# Altium project PROC154E3_SCH.PrjPcb (part 25 of 60)

## Sheet 26. RESET BUTTONs.SchDoc: RESET BUTTONs
size 513 x 386 mm; Project: PROC154E2(001)_SK_AM69; Issue: 1.0; RevCode: E3; Page Create Date: March  8, 1995; Variant Name: Core Design; Schematic Page Number: 26; Page Number: 26; Page Size: C; Comment: MISTRAL_TITLEBLK_CSIZE_1; Page Count: 62; Schematic Page Count: 62; Name: PROC154E2 001 SK AM69; DsnPath: C:\Users\danie\Downloads\sprr466c\PROC154E3_RP\PROC154E3_SCH.DSN; SchematicName: SCHEMATIC1; PageName: 26. RESET BUTTONs; PageSize: C; TopSchematic: True
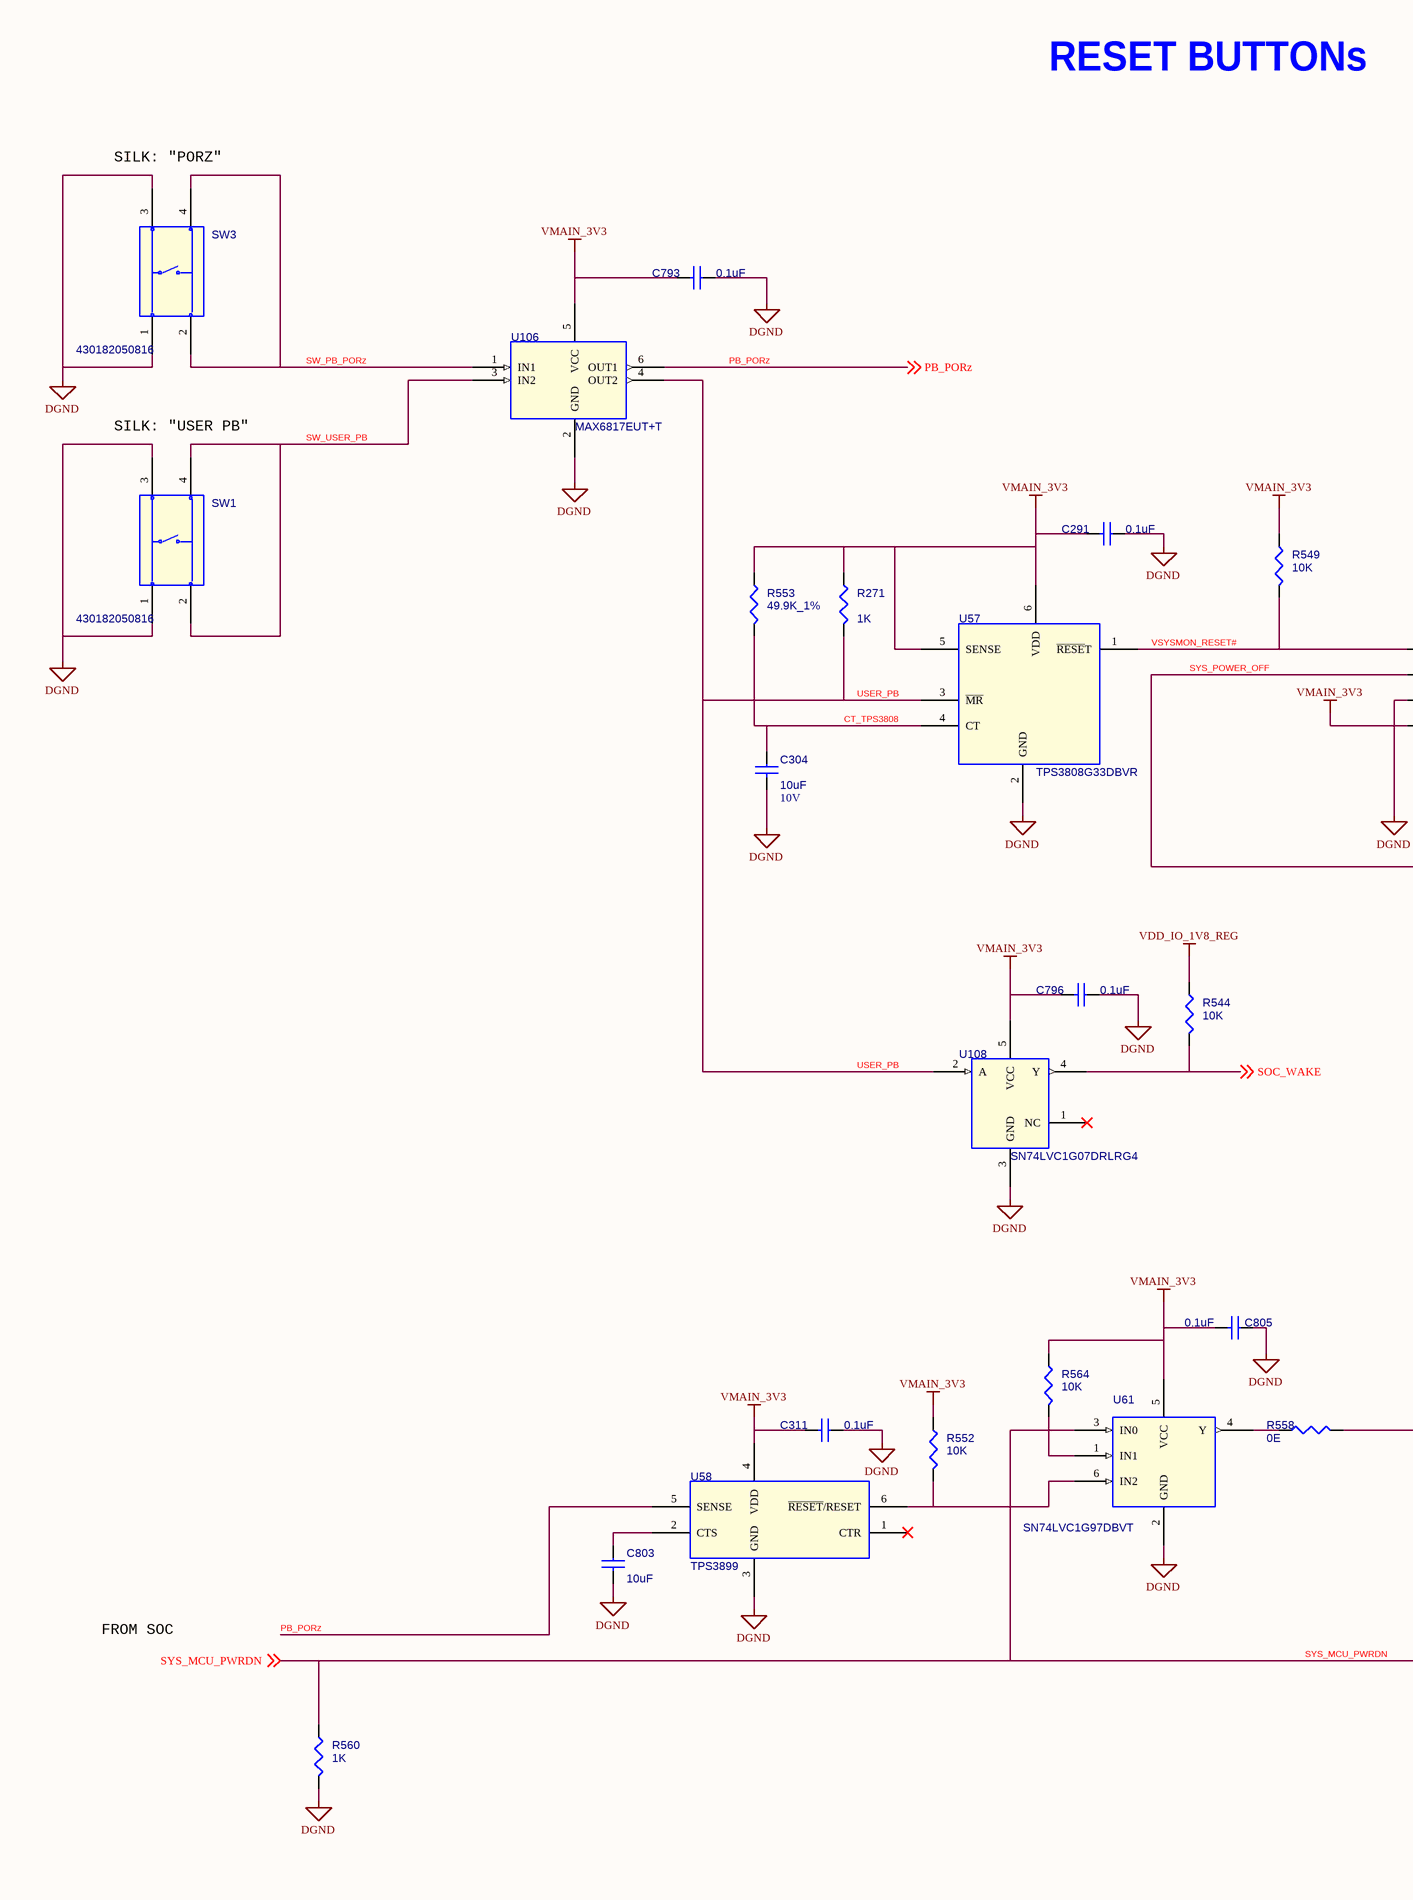
[diagram p40: 26. RESET BUTTONs.SchDoc, left]
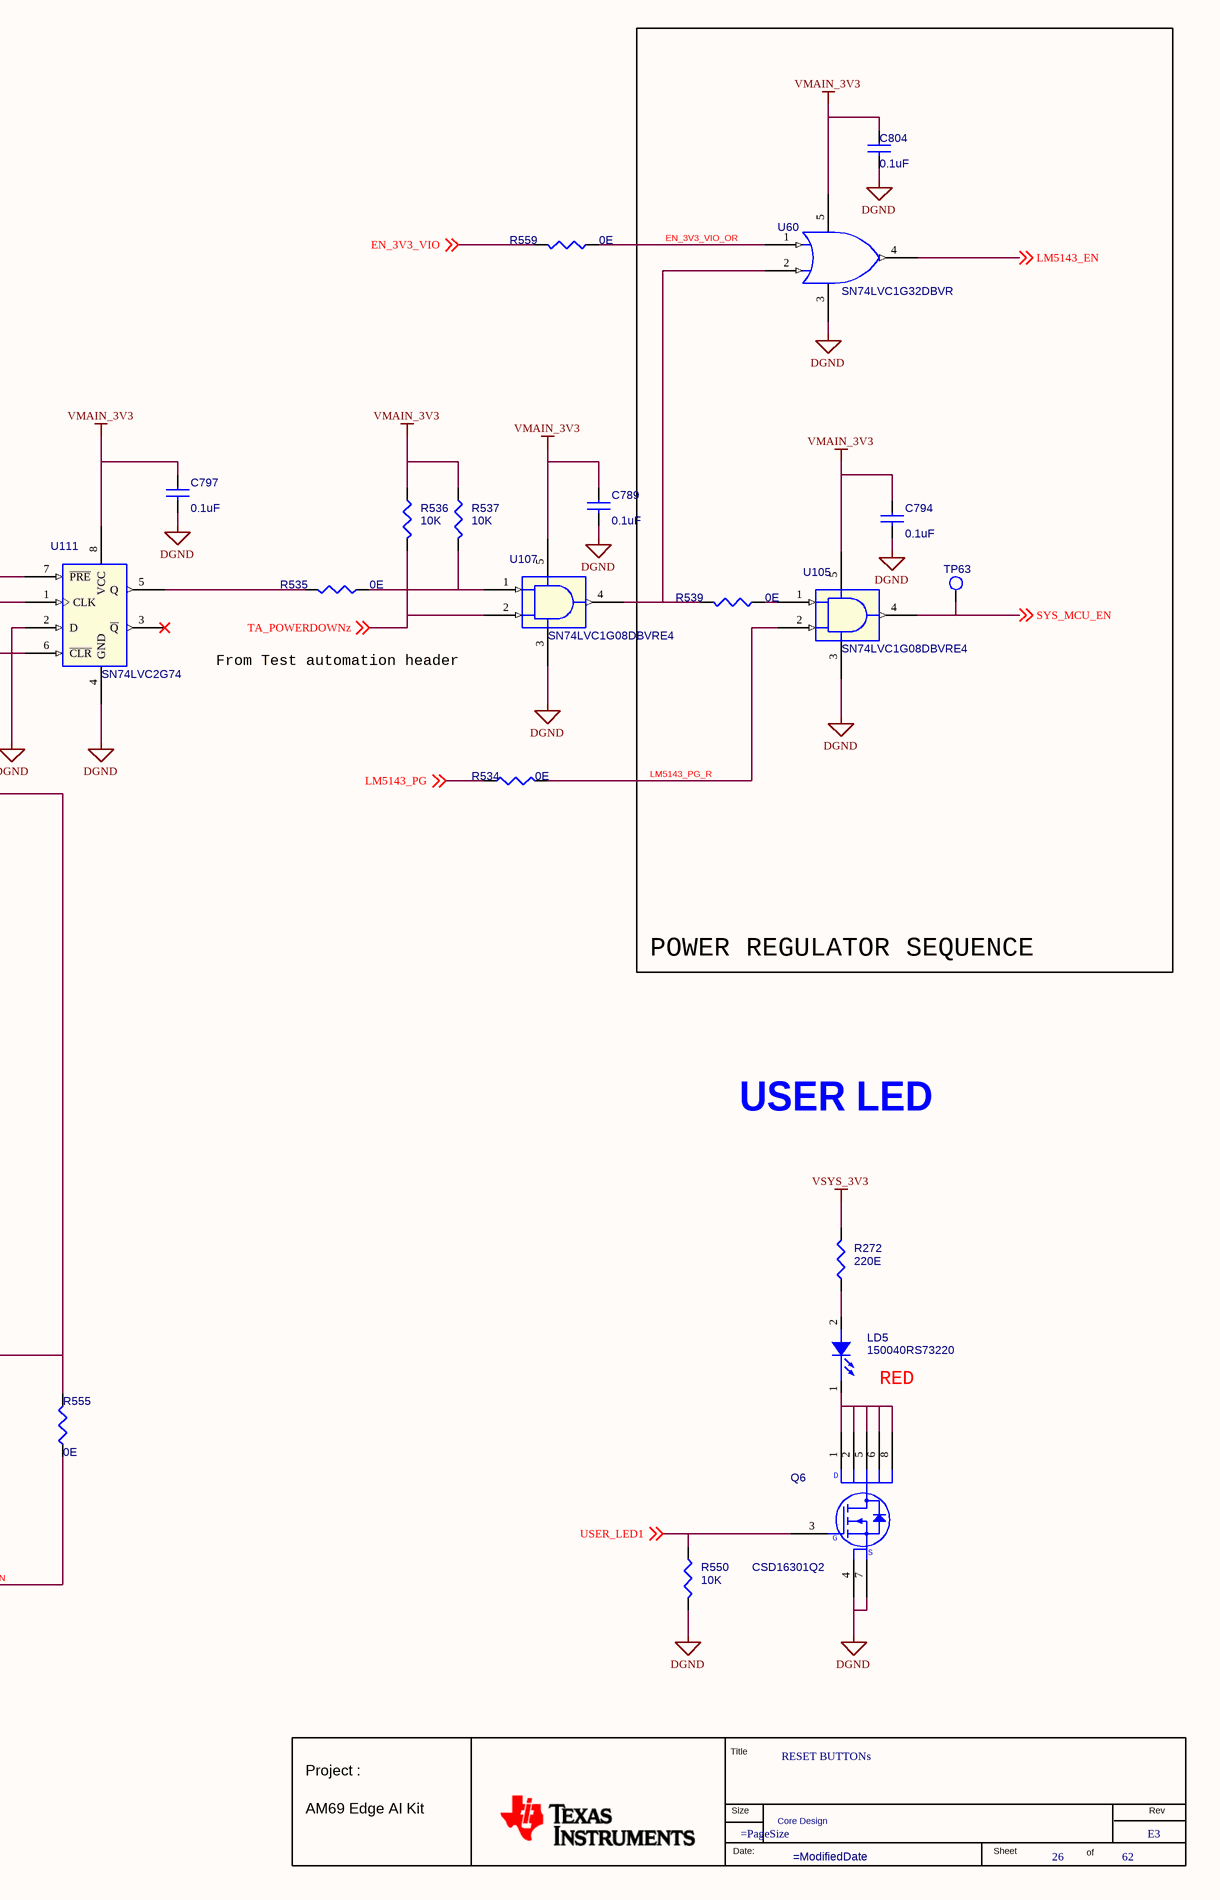
[diagram p41: 26. RESET BUTTONs.SchDoc, right]

### Parts
(Parts that share a designator on the sheet are numbered #1, #2 ... from top to bottom, then left to right.)
*#26  RevCode: E3  Title: RESET BUTTONs  Page Number: 26  Page Count: 62  Variant Name: Core Design  (hidden comment: MISTRAL_TITLEBLK_CSIZE_1)  (graphical)
C291  0.1uF  [CAP0201_0-5]
C304  10uF  Voltage: 10V  [CAP0402_1]
C311  0.1uF  [CAP0201_0-5]
C789  0.1uF  [CAP0201_0-5]
C793  0.1uF  [CAP0201_0-5]
C794  0.1uF  [CAP0201_0-5]
C796  0.1uF  [CAP0201_0-5]
C797  0.1uF  [CAP0201_0-5]
C803  10uF  [CAP0402_1]
C804  0.1uF  [CAP0201_0-5]
C805  0.1uF  [CAP0201_0-5]
LD5  150040RS73220  [LED_150040GS73220_40X20_SMD_0-4]
Q6  CSD16301Q2  [WSON6_CSD13202Q2_80X80_0-8]
R271  1K  [RES0201_0-5]
R272  220E  [RES0402_0-5]
R534  0E  [RES0402_0-5]
R535  0E  [RES0402_0-5]
R536  10K  [RES0201_0-5]
R537  10K  [RES0201_0-5]
R539  0E  [RES0402_0-5]
R544  10K  [RES0201_0-5]
R549  10K  [RES0201_0-5]
R550  10K  [RES0201_0-5]
R552  10K  [RES0201_0-5]
R553  49.9K_1%  [RES0402_0-5]
R555  0E  [RES0402_0-5]
R558  0E  [RES0402_0-5]
R559  0E  [RES0402_0-5]
R560  1K  [RES0201_0-5]
R564  10K  [RES0201_0-5]
SW1  430182050816  [SW4_430182050816_240X240_SMD_5-2]
SW3  430182050816  [SW4_430182050816_240X240_SMD_5-2]
TP63  TP30_SMD  [TP30_SMD]  (value not drawn)
U57  TPS3808G33DBVR  [SOT23-6]
U58  TPS3899  [WSON6_19-68_60X60]
U60  SN74LVC1G32DBVR  [SOT23-5_1-5]
U61  SN74LVC1G97DBVT  [SOT23-6]
U105  SN74LVC1G08DBVRE4  [SOT23-5]
U106  MAX6817EUT+T  [SOT23-6_1-5]
U107  SN74LVC1G08DBVRE4  [SOT23-5]
U108  SN74LVC1G07DRLRG4  [SOT553-5]
U111  SN74LVC2G74  [SSOP8_25-59_120X110_1-3]

### Blocks framed on the sheet
POWER REGULATOR SEQUENCE: C794 C804 R539 TP63 U60 U105

### Nets
DGND: C291.1 C304.2 C311.1 C789.2 C793.1 C794.2 C796.1 C797.2 C803.2 C804.2 C805.1 Q6.4(S1) Q6.7(S2) R550.1 R560.2 SW1.1 SW1.3 SW3.1 SW3.3 U57.2(GND) U58.3(GND) U60.3(GND) U61.2(GND) U105.3(GND) U106.2(GND) U107.3(GND) U108.3(GND) U111.2(D) U111.4(GND)  [project net VDD_CPU_HCPS_GOSNS]
VDD_IO_1V8_REG: R544.2
VMAIN_3V3: C291.2 C311.2 C789.1 C793.2 C794.1 C796.2 C797.1 C804.1 C805.2 R271.1 R536.2 R537.2 R549.2 R552.2 R553.1 R564.2 U57.5(SENSE) U57.6(VDD) U58.4(VDD) U60.5(VCC) U61.5(VCC) U105.5(VCC) U106.5(VCC) U107.5(VCC) U108.5(VCC) U111.6(~{CLR}) U111.8(VCC)
VSYS_3V3: R272.2  [project net V_3V3]
 EN_3V3_VIO_OR: R559.1 U60.1(A)
CT_TPS3808: C304.1 R553.2 U57.4(CT)
EN_3V3_VIO: R559.2 ; off-sheet EN_3V3_VIO
LM5143_EN: U60.4(Y) ; off-sheet LM5143_EN  [project net LM5143_ON]
LM5143_PG: R534.1 ; off-sheet LM5143_PG
LM5143_PG_R: R534.2 U105.2(B)
PB_PORz: U58.5(SENSE) U106.6(OUT1) ; off-sheet PB_PORz
SOC_WAKE: R544.1 U108.4(Y) ; off-sheet SOC_WAKE
SW_PB_PORz: SW3.2 SW3.4 U106.1(IN1)
SW_USER_PB: SW1.2 SW1.4 U106.3(IN2)
SYS_MCU_EN: TP63.1(TP) U105.4(Y) ; off-sheet SYS_MCU_EN
SYS_MCU_PWRDN: R555.1 R560.1 U61.3(IN0) ; off-sheet SYS_MCU_PWRDN
SYS_POWER_OFF: R555.2 R558.2 U111.1(CLK)
TA_POWERDOWNz: R536.1 U107.2(B) ; off-sheet TA_POWERDOWNz
USER_LED1: Q6.3(G) R550.2 ; off-sheet USER_LED1
USER_PB: R271.2 U57.3(~{MR}) U106.4(OUT2) U108.2(A)
VSYSMON_RESET#: R549.1 U57.1(~{RESE}T) U111.7(~{PRE})
NetC803_1: C803.1 U58.2(CTS)
NetLD5_1: LD5.1(CATHODE) Q6.1(D1) Q6.2(D2) Q6.5(D3) Q6.6(D4) Q6.8(D5)
NetLD5_2: LD5.2(ANODE) R272.1
NetR535_1: R535.1 R537.1 U107.1(A)
NetR535_2: R535.2 U111.5(Q)
NetR539_1: R539.1 U105.1(A)
NetR539_2: R539.2 U60.2(B) U107.4(Y)
NetR552_1: R552.1 U58.6(~{RESET}/RESET) U61.6(IN2)
NetR558_1: R558.1 U61.4(Y)
NetR564_1: R564.1 U61.1(IN1)

Not connected (* = marked no-connect by the designer): U58 1(CTR)*; U108 1(NC)*; U111 3(~{Q})*

### Notes on the sheet
- RESET BUTTONs
- SILK: "PORZ"
- SILK: "USER PB"
- From Test automation header
- USER LED
- (near LD5) RED
- FROM SOC
- (in symbol MISTRAL_TITLEBLK_CSIZE_1) Title; Project :; Size; Rev; AM69 Edge AI Kit; Date:; Sheet; of
- (in symbol MOSFET_CSD17313Q2) D; S

### Library data of the parts
*#26 = MISTRAL_TITLEBLK_CSIZE_1: as *#25 on sheet 25. SOC GND & KELVIN SENSING; Page Create Date: March  8, 1995; Page Size: =PageSize; Page Modify Date: =ModifiedDate; Schematic Page Count: 62; Schematic Page Number: 26
C291 = CAP_Dup1: CAP CERAMIC 0.1uF 16V 10% X7S AUTO 0201; Part Reference: C291; Mistral Part No: 120021030007-R; Mfr_name: MURATA; Mfr_part_number: GRT033C71C104KE01D; Part_type: CAPACITORS\CERAMIC; Project: J7ES_SK_BRD; Wattage: NA; Customs_HS_Code: 85322990; Custom_Duty: 15%; Value: 0.1uF; Tolerance: 10%; Voltage: 16V; Package: 0201; Distributor_name: DIGIKEY; Distributor_part_number: 490-GRT033C71C104KE01DTR-ND; Height: 0.33MM; Weight: 330mg; Temperature: -55°C+125°C; Datasheet: Y:\MIS_DATABASE\DATASHEETS\CAPACITORS\GRT033C71C104KE01.PDF; Crtd /date: ALVY/110321; Chkd/date: MANIRAJA/110321; MECHANICAL 3D STEP FILE: CAP0201_0-5; PCB Footprint: CAP0201_0-5
C304 = CAP_Dup1: CAP CERAMIC 10uF 10V 20% X5R 0402; Part Reference: C304; Mistral Part No: 120019020008-R; Mfr_name: SAMSUNG; Mfr_part_number: CL05A106MP8NUB8; Part_type: CAPACITORS\CERAMIC; Project: TI_60GHz-AOP; Customs_HS_Code: 85322990; Custom_Duty: 15%; Wattage: NA; Value: 10uF; Library Ref: CAP; Tolerance: 20%; Package: 0402; Distributor_name: DIGIKEY; Distributor_part_number: 1276-6830-1-ND; Height: 0.90MM; Datasheet: Y:\MIS_DATABASE\DATASHEETS\CAPACITORS\CL05A106MP8NUB8.PDF; Crtd /date: ALVY/150219; Chkd/date: MANIRAJA/150219; Footprint Ref: CAP0402_1; Weight: NA; Temperature: -55°C+85°C; MECHANICAL 3D STEP FILE: CAP0402_1; Library Path: Y:\MIS_DATABASE\Library\ALTIUM_TOOL\SCHEMATICS_PARTS\MS_DISCRETE_Library.schlib; Footprint Path: Y:\MIS_DATABASE\Library\ALTIUM_TOOL\PCB_FOOTPRINTS\Altium_Footprint_Lib.PcbLib; PCB Footprint: CAP0402_1
C311 = CAP_Dup1: CAP CERAMIC 0.1uF 16V 10% X7S AUTO 0201; Part Reference: C311; Mistral Part No: 120021030007-R; Mfr_name: MURATA; Mfr_part_number: GRT033C71C104KE01D; Part_type: CAPACITORS\CERAMIC; Project: J7ES_SK_BRD; Wattage: NA; Customs_HS_Code: 85322990; Custom_Duty: 15%; Value: 0.1uF; Tolerance: 10%; Voltage: 16V; Package: 0201; Distributor_name: DIGIKEY; Distributor_part_number: 490-GRT033C71C104KE01DTR-ND; Height: 0.33MM; Weight: 330mg; Temperature: -55°C+125°C; Datasheet: Y:\MIS_DATABASE\DATASHEETS\CAPACITORS\GRT033C71C104KE01.PDF; Crtd /date: ALVY/110321; Chkd/date: MANIRAJA/110321; MECHANICAL 3D STEP FILE: CAP0201_0-5; PCB Footprint: CAP0201_0-5
C789 = CAP_Dup1: CAP CERAMIC 0.1uF 16V 10% X7S AUTO 0201; Part Reference: C789; Mistral Part No: 120021030007-R; Mfr_name: MURATA; Mfr_part_number: GRT033C71C104KE01D; Part_type: CAPACITORS\CERAMIC; Project: J7ES_SK_BRD; Wattage: NA; Customs_HS_Code: 85322990; Custom_Duty: 15%; Value: 0.1uF; Tolerance: 10%; Voltage: 16V; Package: 0201; Distributor_name: DIGIKEY; Distributor_part_number: 490-GRT033C71C104KE01DTR-ND; Height: 0.33MM; Weight: 330mg; Temperature: -55°C+125°C; Datasheet: Y:\MIS_DATABASE\DATASHEETS\CAPACITORS\GRT033C71C104KE01.PDF; Crtd /date: ALVY/110321; Chkd/date: MANIRAJA/110321; MECHANICAL 3D STEP FILE: CAP0201_0-5; PCB Footprint: CAP0201_0-5
C793 = CAP_Dup1: CAP CERAMIC 0.1uF 16V 10% X7S AUTO 0201; Part Reference: C793; Part_type: CAPACITORS\CERAMIC; Mfr_part_number: GRT033C71C104KE01D; Mfr_name: MURATA; Mistral Part No: 120021030007-R; Custom_Duty: 15%; Customs_HS_Code: 85322990; Wattage: NA; Project: J7ES_SK_BRD; Value: 0.1uF; MECHANICAL 3D STEP FILE: CAP0201_0-5; Chkd/date: MANIRAJA/110321; Crtd /date: ALVY/110321; Datasheet: Y:\MIS_DATABASE\DATASHEETS\CAPACITORS\GRT033C71C104KE01.PDF; Temperature: -55°C+125°C; Weight: 330mg; Height: 0.33MM; Distributor_part_number: 490-GRT033C71C104KE01DTR-ND; Distributor_name: DIGIKEY; Package: 0201; Voltage: 16V; Tolerance: 10%; PCB Footprint: CAP0201_0-5
C794 = CAP_Dup1: CAP CERAMIC 0.1uF 16V 10% X7S AUTO 0201; Part Reference: C794; Part_type: CAPACITORS\CERAMIC; Mfr_part_number: GRT033C71C104KE01D; Mfr_name: MURATA; Mistral Part No: 120021030007-R; Custom_Duty: 15%; Customs_HS_Code: 85322990; Wattage: NA; Project: J7ES_SK_BRD; Value: 0.1uF; MECHANICAL 3D STEP FILE: CAP0201_0-5; Chkd/date: MANIRAJA/110321; Crtd /date: ALVY/110321; Datasheet: Y:\MIS_DATABASE\DATASHEETS\CAPACITORS\GRT033C71C104KE01.PDF; Temperature: -55°C+125°C; Weight: 330mg; Height: 0.33MM; Distributor_part_number: 490-GRT033C71C104KE01DTR-ND; Distributor_name: DIGIKEY; Package: 0201; Voltage: 16V; Tolerance: 10%; PCB Footprint: CAP0201_0-5
C796 = CAP_Dup1: CAP CERAMIC 0.1uF 16V 10% X7S AUTO 0201; Part Reference: C796; Part_type: CAPACITORS\CERAMIC; Mfr_part_number: GRT033C71C104KE01D; Mfr_name: MURATA; Mistral Part No: 120021030007-R; Custom_Duty: 15%; Customs_HS_Code: 85322990; Wattage: NA; Project: J7ES_SK_BRD; Value: 0.1uF; MECHANICAL 3D STEP FILE: CAP0201_0-5; Chkd/date: MANIRAJA/110321; Crtd /date: ALVY/110321; Datasheet: Y:\MIS_DATABASE\DATASHEETS\CAPACITORS\GRT033C71C104KE01.PDF; Temperature: -55°C+125°C; Weight: 330mg; Height: 0.33MM; Distributor_part_number: 490-GRT033C71C104KE01DTR-ND; Distributor_name: DIGIKEY; Package: 0201; Voltage: 16V; Tolerance: 10%; PCB Footprint: CAP0201_0-5
C797 = CAP_Dup1: CAP CERAMIC 0.1uF 16V 10% X7S AUTO 0201; Part Reference: C797; Mistral Part No: 120021030007-R; Mfr_name: MURATA; Mfr_part_number: GRT033C71C104KE01D; Part_type: CAPACITORS\CERAMIC; Project: J7ES_SK_BRD; Wattage: NA; Customs_HS_Code: 85322990; Custom_Duty: 15%; Value: 0.1uF; Tolerance: 10%; Voltage: 16V; Package: 0201; Distributor_name: DIGIKEY; Distributor_part_number: 490-GRT033C71C104KE01DTR-ND; Height: 0.33MM; Weight: 330mg; Temperature: -55°C+125°C; Datasheet: Y:\MIS_DATABASE\DATASHEETS\CAPACITORS\GRT033C71C104KE01.PDF; Crtd /date: ALVY/110321; Chkd/date: MANIRAJA/110321; MECHANICAL 3D STEP FILE: CAP0201_0-5; PCB Footprint: CAP0201_0-5
C803 = CAP_Dup1: CAP CERAMIC 10uF 10V 20% X5R 0402; Part Reference: C803; Mistral Part No: 120019020008-R; Mfr_name: SAMSUNG; Mfr_part_number: CL05A106MP8NUB8; Part_type: CAPACITORS\CERAMIC; Project: TI_60GHz-AOP; Wattage: NA; Customs_HS_Code: 85322990; Custom_Duty: 15%; Value: 10uF; Tolerance: 20%; Voltage: 10V; Package: 0402; Distributor_name: DIGIKEY; Distributor_part_number: 1276-6830-1-ND; Library Ref: CAP; Footprint Ref: CAP0402_1; Height: 0.90MM; Weight: NA; Temperature: -55°C+85°C; Datasheet: Y:\MIS_DATABASE\DATASHEETS\CAPACITORS\CL05A106MP8NUB8.PDF; Crtd /date: ALVY/150219; Chkd/date: MANIRAJA/150219; MECHANICAL 3D STEP FILE: CAP0402_1; Library Path: Y:\MIS_DATABASE\Library\ALTIUM_TOOL\SCHEMATICS_PARTS\MS_DISCRETE_Library.schlib; Footprint Path: Y:\MIS_DATABASE\Library\ALTIUM_TOOL\PCB_FOOTPRINTS\Altium_Footprint_Lib.PcbLib; PCB Footprint: CAP0402_1
C804 = CAP_Dup1: CAP CERAMIC 0.1uF 16V 10% X7S AUTO 0201; Part Reference: C804; Part_type: CAPACITORS\CERAMIC; Mfr_part_number: GRT033C71C104KE01D; Mfr_name: MURATA; Mistral Part No: 120021030007-R; Custom_Duty: 15%; Customs_HS_Code: 85322990; Wattage: NA; Project: J7ES_SK_BRD; Value: 0.1uF; MECHANICAL 3D STEP FILE: CAP0201_0-5; Chkd/date: MANIRAJA/110321; Crtd /date: ALVY/110321; Datasheet: Y:\MIS_DATABASE\DATASHEETS\CAPACITORS\GRT033C71C104KE01.PDF; Temperature: -55°C+125°C; Weight: 330mg; Height: 0.33MM; Distributor_part_number: 490-GRT033C71C104KE01DTR-ND; Distributor_name: DIGIKEY; Package: 0201; Voltage: 16V; Tolerance: 10%; PCB Footprint: CAP0201_0-5
C805 = CAP_Dup1: CAP CERAMIC 0.1uF 16V 10% X7S AUTO 0201; Part Reference: C805; Part_type: CAPACITORS\CERAMIC; Mfr_part_number: GRT033C71C104KE01D; Mfr_name: MURATA; Mistral Part No: 120021030007-R; Custom_Duty: 15%; Customs_HS_Code: 85322990; Wattage: NA; Project: J7ES_SK_BRD; Value: 0.1uF; MECHANICAL 3D STEP FILE: CAP0201_0-5; Chkd/date: MANIRAJA/110321; Crtd /date: ALVY/110321; Datasheet: Y:\MIS_DATABASE\DATASHEETS\CAPACITORS\GRT033C71C104KE01.PDF; Temperature: -55°C+125°C; Weight: 330mg; Height: 0.33MM; Distributor_part_number: 490-GRT033C71C104KE01DTR-ND; Distributor_name: DIGIKEY; Package: 0201; Voltage: 16V; Tolerance: 10%; PCB Footprint: CAP0201_0-5
LD5 = DIODE_LED: DIODE LED RED SMD; Part Reference: LD5; Part_type: OPTO\LED; Mfr_name: WURTH ELECTRONICS; Mistral Part No: 130020090020-R; Custom_Duty: 24%; Customs_HS_Code: 85439000; Wattage: NA; Project: AM64X_SKEVM; Value: 150040RS73220; PCB Footprint: LED_150040GS73220_40X20_SMD_0-4; Footprint Path: Y:\MIS_DATABASE\Library\ALTIUM_TOOL\PCB_FOOTPRINTS\Altium_Footprint_Lib.PcbLib; Library Path: Y:\MIS_DATABASE\Library\ALTIUM_TOOL\SCHEMATICS_PARTS\MS_OPTO_Library.schlib; MECHANICAL 3D STEP FILE: LED_150040GS73220_40X20_SMD_0-4; Chkd/date: MANIRAJA/100920; Crtd /date: ALVY/100920; Datasheet: Y:\MIS_DATABASE\DATASHEETS\DISCRETES\LEDS\150040RS73220.PDF; Temperature: -40°C+85°C; Weight: 29.3mg; Height: 0.35MM; Library Ref: DIODE_LED; Distributor_part_number: 732-13422-1-ND; Distributor_name: DIGIKEY; Package: SMD; Voltage: NA; Tolerance: NA; Mfr_part_number: 150040RS73220; Footprint Ref: LED_150040GS73220_40X20_SMD_0-4
Q6 = MOSFET_CSD17313Q2: IC MOSFET N-CHANNEL NEXFET 25V WSON6; Part Reference: Q6; Mistral Part No: 142020120008-R; Mfr_name: TEXAS INSTRUMENTS; Part_type: ICS\POWER\MOSFET; Project: TI_AM243x LP EVM; Tolerance: NA; Customs_HS_Code: 85423100; Custom_Duty: 15%; Value: CSD16301Q2; PCB Footprint: WSON6_CSD13202Q2_80X80_0-8; Footprint Ref: WSON6_CSD13202Q2_80X80_0-8; Mfr_part_number: CSD16301Q2; Voltage: NA; Wattage: NA; Package: WSON6; Distributor_name: DIGIKEY; Distributor_part_number: 296-25260-1-ND; Library Ref: MOSFET_CSD17313Q2; Height: 0.80MM; Weight: 8.7mg; Temperature: -55°C+150°C; Datasheet: Y:\MIS_DATABASE\DATASHEETS\ICS\POWER\CSD16301Q2.PDF; Crtd /date: MANIRAJA/071220; Chkd/date: ALVY/071220; MECHANICAL 3D STEP FILE: WSON6_CSD13202Q2_80X80_0-8; Library Path: Y:\MIS_DATABASE\Library\ALTIUM_TOOL\SCHEMATICS_PARTS\MS_MOSFET_Library.schlib; Footprint Path: Y:\MIS_DATABASE\Library\ALTIUM_TOOL\PCB_FOOTPRINTS\Altium_Footprint_Lib.PcbLib
R271 = RESISTOR_Dup1: RES 1K 1/20W 5% 0201; Part Reference: R271; Mistral Part No: 110009030395-R; Mfr_name: YAGEO AMERICA; Mfr_part_number: RC0201JR-071KL; Part_type: RESISTORS\FIXED; Project: GOLDEN-I LITE; Voltage: NA; Customs_HS_Code: 85332119; Custom_Duty: 15%; Value: 1K; Tolerance: 5%; Wattage: 1/20W; Package: 0201; Distributor_name: DIGIKEY; Distributor_part_number: 311-1KNCT-ND; Height: 0.26MM; Weight: 0.17mg; Temperature: -55°C+125°C; Datasheet: Y:\MIS_DATABASE\DATASHEETS\RESISTORS\RCXXXXL-SER_MAR18.PDF; Crtd /date: MANIRAJA/050517; Chkd/date: MANIRAJA/050517; Library Ref: RESISTOR; Footprint Ref: RES0201_0-5; MECHANICAL 3D STEP FILE: RES0201_0-5; Library Path: Y:\MIS_DATABASE\Library\ALTIUM_TOOL\SCHEMATICS_PARTS\MS_DISCRETE_Library.schlib; Footprint Path: Y:\MIS_DATABASE\Library\ALTIUM_TOOL\PCB_FOOTPRINTS\Altium_Footprint_Lib.PcbLib; PCB Footprint: RES0201_0-5
R272 = RESISTOR_Dup2: RES 220E 1/16W 5% 0402; Part Reference: R272; Part_type: RESISTORS\FIXED; Mfr_part_number: RC0402JR-07220RL; Mfr_name: YAGEO AMERICA; Mistral Part No: 110020120013-R; Custom_Duty: 15%; Customs_HS_Code: 85332119; Voltage: NA; Project: TI_AM243x LP EVM; Value: 220E; PCB Footprint: RES0402_0-5; Footprint Path: Y:\MIS_DATABASE\Library\ALTIUM_TOOL\PCB_FOOTPRINTS\Altium_Footprint_Lib.PcbLib; Library Path: Y:\MIS_DATABASE\Library\ALTIUM_TOOL\SCHEMATICS_PARTS\MS_DISCRETE_Library.schlib; Footprint Ref: RES0402_0-5; MECHANICAL 3D STEP FILE: RES0402_0-5; Chkd/date: ALVY/091220; Crtd /date: MANIRAJA/091220; Datasheet: Y:\MIS_DATABASE\DATASHEETS\RESISTORS\RCXXXXL-SER_MAR18.PDF; Temperature: -55°C+155°C; Weight: 0.65mg; Height: 0.40MM; Distributor_part_number: 311-220JRCT-ND; Distributor_name: DIGIKEY; Package: 0402; Wattage: 1/16W; Tolerance: 5%; Library Ref: RESISTOR
R534 = RESISTOR_Dup1: RES 0E 1/10W JUMPER 0402; Part Reference: R534; Part_type: RESISTORS\FIXED; Mfr_part_number: ERJ-2GE0R00X; Mfr_name: PANASONIC-ECG; Mistral Part No: 110018030052-R; Custom_Duty: 15%; Customs_HS_Code: 85332119; Voltage: NA; Project: AEGIS POM; Value: 0E; Footprint Path: Y:\MIS_DATABASE\Library\ALTIUM_TOOL\PCB_FOOTPRINTS\Altium_Footprint_Lib.PcbLib; Library Path: Y:\MIS_DATABASE\Library\ALTIUM_TOOL\SCHEMATICS_PARTS\MS_DISCRETE_Library.schlib; Footprint Ref: RES0402_0-5; Library Ref: RESISTOR; Chkd/date: VASANTHA/061216; Crtd /date: NAVEED/201014; Datasheet: Y:\MIS_DATABASE\DATASHEETS\RESISTORS\PAN-ERJSER_NOV17.PDF; Temperature: -55°C+155°C; Weight: 0.8mg; Height: 0.40MM; Distributor_part_number: P0.0JCT-ND; Distributor_name: DIGIKEY; Package: 0402; Wattage: 1/10W; Tolerance: NA; MECHANICAL 3D STEP FILE: RES0402_0-5; PCB Footprint: RES0402_0-5
R535 = RESISTOR_Dup2: RES 0E 1/10W JUMPER 0402; Part Reference: R535; Mistral Part No: 110018030052-R; Mfr_name: PANASONIC-ECG; Mfr_part_number: ERJ-2GE0R00X; Part_type: RESISTORS\FIXED; Project: AEGIS POM; Tolerance: NA; Customs_HS_Code: 85332119; Custom_Duty: 15%; Value: 0E; Footprint Path: Y:\MIS_DATABASE\Library\ALTIUM_TOOL\PCB_FOOTPRINTS\Altium_Footprint_Lib.PcbLib; Library Path: Y:\MIS_DATABASE\Library\ALTIUM_TOOL\SCHEMATICS_PARTS\MS_DISCRETE_Library.schlib; Footprint Ref: RES0402_0-5; Library Ref: RESISTOR; Voltage: NA; Wattage: 1/10W; Package: 0402; Distributor_name: DIGIKEY; Distributor_part_number: P0.0JCT-ND; Height: 0.40MM; Weight: 0.8mg; Temperature: -55°C+155°C; Datasheet: Y:\MIS_DATABASE\DATASHEETS\RESISTORS\PAN-ERJSER_NOV17.PDF; Crtd /date: NAVEED/201014; Chkd/date: VASANTHA/061216; MECHANICAL 3D STEP FILE: RES0402_0-5; PCB Footprint: RES0402_0-5
R536 = RESISTOR_Dup2: RES 10K 1/20W 5% 0201; Part Reference: R536; Mistral Part No: 110010070051-R; Mfr_name: YAGEO AMERICA; Mfr_part_number: RC0201JR-0710KL; Part_type: RESISTORS\FIXED; Project: GOLDEN-I LITE; Voltage: NA; Customs_HS_Code: 85332119; Custom_Duty: 15%; Value: 10K; Footprint Path: Y:\MIS_DATABASE\Library\ALTIUM_TOOL\PCB_FOOTPRINTS\Altium_Footprint_Lib.PcbLib; Library Path: Y:\MIS_DATABASE\Library\ALTIUM_TOOL\SCHEMATICS_PARTS\MS_DISCRETE_Library.schlib; Footprint Ref: RES0201_0-5; Library Ref: RESISTOR; Tolerance: 5%; Wattage: 1/20W; Package: 0201; Distributor_name: DIGIKEY; Distributor_part_number: 311-10KNCT-ND; Height: 0.26MM; Weight: 0.17mg; Temperature: -55°C+125°C; Datasheet: Y:\MIS_DATABASE\DATASHEETS\RESISTORS\RCXXXXL-SER_MAR18.PDF; Crtd /date: MANIRAJA/050517; Chkd/date: MANIRAJA/050517; MECHANICAL 3D STEP FILE: RES0201_0-5; PCB Footprint: RES0201_0-5
R537 = RESISTOR_Dup2: RES 10K 1/20W 5% 0201; Part Reference: R537; Mistral Part No: 110010070051-R; Mfr_name: YAGEO AMERICA; Mfr_part_number: RC0201JR-0710KL; Part_type: RESISTORS\FIXED; Project: GOLDEN-I LITE; Voltage: NA; Customs_HS_Code: 85332119; Custom_Duty: 15%; Value: 10K; Footprint Path: Y:\MIS_DATABASE\Library\ALTIUM_TOOL\PCB_FOOTPRINTS\Altium_Footprint_Lib.PcbLib; Library Path: Y:\MIS_DATABASE\Library\ALTIUM_TOOL\SCHEMATICS_PARTS\MS_DISCRETE_Library.schlib; Footprint Ref: RES0201_0-5; Library Ref: RESISTOR; Tolerance: 5%; Wattage: 1/20W; Package: 0201; Distributor_name: DIGIKEY; Distributor_part_number: 311-10KNCT-ND; Height: 0.26MM; Weight: 0.17mg; Temperature: -55°C+125°C; Datasheet: Y:\MIS_DATABASE\DATASHEETS\RESISTORS\RCXXXXL-SER_MAR18.PDF; Crtd /date: MANIRAJA/050517; Chkd/date: MANIRAJA/050517; MECHANICAL 3D STEP FILE: RES0201_0-5; PCB Footprint: RES0201_0-5
R539 = RESISTOR_Dup2: RES 0E 1/10W JUMPER 0402; Part Reference: R539; Part_type: RESISTORS\FIXED; Mfr_part_number: ERJ-2GE0R00X; Mfr_name: PANASONIC-ECG; Mistral Part No: 110018030052-R; Custom_Duty: 15%; Customs_HS_Code: 85332119; Voltage: NA; Project: AEGIS POM; Value: 0E; MECHANICAL 3D STEP FILE: RES0402_0-5; Chkd/date: VASANTHA/061216; Crtd /date: NAVEED/201014; Datasheet: Y:\MIS_DATABASE\DATASHEETS\RESISTORS\PAN-ERJSER_NOV17.PDF; Temperature: -55°C+155°C; Weight: 0.8mg; Height: 0.40MM; Distributor_part_number: P0.0JCT-ND; Distributor_name: DIGIKEY; Package: 0402; Wattage: 1/10W; Tolerance: NA; Library Ref: RESISTOR; Footprint Ref: RES0402_0-5; Library Path: Y:\MIS_DATABASE\Library\ALTIUM_TOOL\SCHEMATICS_PARTS\MS_DISCRETE_Library.schlib; Footprint Path: Y:\MIS_DATABASE\Library\ALTIUM_TOOL\PCB_FOOTPRINTS\Altium_Footprint_Lib.PcbLib; PCB Footprint: RES0402_0-5
R544 = RESISTOR_Dup2: RES 10K 1/20W 5% 0201; Part Reference: R544; Part_type: RESISTORS\FIXED; Mfr_part_number: RC0201JR-0710KL; Mfr_name: YAGEO AMERICA; Mistral Part No: 110010070051-R; Custom_Duty: 15%; Customs_HS_Code: 85332119; Voltage: NA; Project: GOLDEN-I LITE; Value: 10K; MECHANICAL 3D STEP FILE: RES0201_0-5; Chkd/date: MANIRAJA/050517; Crtd /date: MANIRAJA/050517; Datasheet: Y:\MIS_DATABASE\DATASHEETS\RESISTORS\RCXXXXL-SER_MAR18.PDF; Temperature: -55°C+125°C; Weight: 0.17mg; Height: 0.26MM; Distributor_part_number: 311-10KNCT-ND; Distributor_name: DIGIKEY; Package: 0201; Wattage: 1/20W; Tolerance: 5%; Library Ref: RESISTOR; Footprint Ref: RES0201_0-5; Library Path: Y:\MIS_DATABASE\Library\ALTIUM_TOOL\SCHEMATICS_PARTS\MS_DISCRETE_Library.schlib; Footprint Path: Y:\MIS_DATABASE\Library\ALTIUM_TOOL\PCB_FOOTPRINTS\Altium_Footprint_Lib.PcbLib; PCB Footprint: RES0201_0-5
R549 = RESISTOR_Dup2: RES 10K 1/20W 5% 0201; Part Reference: R549; Mistral Part No: 110010070051-R; Mfr_name: YAGEO AMERICA; Mfr_part_number: RC0201JR-0710KL; Part_type: RESISTORS\FIXED; Project: GOLDEN-I LITE; Voltage: NA; Customs_HS_Code: 85332119; Custom_Duty: 15%; Value: 10K; Footprint Path: Y:\MIS_DATABASE\Library\ALTIUM_TOOL\PCB_FOOTPRINTS\Altium_Footprint_Lib.PcbLib; Library Path: Y:\MIS_DATABASE\Library\ALTIUM_TOOL\SCHEMATICS_PARTS\MS_DISCRETE_Library.schlib; Footprint Ref: RES0201_0-5; Library Ref: RESISTOR; Tolerance: 5%; Wattage: 1/20W; Package: 0201; Distributor_name: DIGIKEY; Distributor_part_number: 311-10KNCT-ND; Height: 0.26MM; Weight: 0.17mg; Temperature: -55°C+125°C; Datasheet: Y:\MIS_DATABASE\DATASHEETS\RESISTORS\RCXXXXL-SER_MAR18.PDF; Crtd /date: MANIRAJA/050517; Chkd/date: MANIRAJA/050517; MECHANICAL 3D STEP FILE: RES0201_0-5; PCB Footprint: RES0201_0-5
R550 = RESISTOR_Dup2: RES 10K 1/20W 5% 0201; Part Reference: R550; Mistral Part No: 110010070051-R; Mfr_name: YAGEO AMERICA; Mfr_part_number: RC0201JR-0710KL; Part_type: RESISTORS\FIXED; Project: GOLDEN-I LITE; Voltage: NA; Customs_HS_Code: 85332119; Custom_Duty: 15%; Value: 10K; PCB Footprint: RES0201_0-5; Footprint Path: Y:\MIS_DATABASE\Library\ALTIUM_TOOL\PCB_FOOTPRINTS\Altium_Footprint_Lib.PcbLib; Library Path: Y:\MIS_DATABASE\Library\ALTIUM_TOOL\SCHEMATICS_PARTS\MS_DISCRETE_Library.schlib; Footprint Ref: RES0201_0-5; Library Ref: RESISTOR; Tolerance: 5%; Wattage: 1/20W; Package: 0201; Distributor_name: DIGIKEY; Distributor_part_number: 311-10KNCT-ND; Height: 0.26MM; Weight: 0.17mg; Temperature: -55°C+125°C; Datasheet: Y:\MIS_DATABASE\DATASHEETS\RESISTORS\RCXXXXL-SER_MAR18.PDF; Crtd /date: MANIRAJA/050517; Chkd/date: MANIRAJA/050517; MECHANICAL 3D STEP FILE: RES0201_0-5
R552 = RESISTOR_Dup2: RES 10K 1/20W 5% 0201; Part Reference: R552; Part_type: RESISTORS\FIXED; Mfr_part_number: RC0201JR-0710KL; Mfr_name: YAGEO AMERICA; Mistral Part No: 110010070051-R; Custom_Duty: 15%; Customs_HS_Code: 85332119; Voltage: NA; Project: GOLDEN-I LITE; Value: 10K; MECHANICAL 3D STEP FILE: RES0201_0-5; Chkd/date: MANIRAJA/050517; Crtd /date: MANIRAJA/050517; Datasheet: Y:\MIS_DATABASE\DATASHEETS\RESISTORS\RCXXXXL-SER_MAR18.PDF; Temperature: -55°C+125°C; Weight: 0.17mg; Height: 0.26MM; Distributor_part_number: 311-10KNCT-ND; Distributor_name: DIGIKEY; Package: 0201; Wattage: 1/20W; Tolerance: 5%; Library Ref: RESISTOR; Footprint Ref: RES0201_0-5; Library Path: Y:\MIS_DATABASE\Library\ALTIUM_TOOL\SCHEMATICS_PARTS\MS_DISCRETE_Library.schlib; Footprint Path: Y:\MIS_DATABASE\Library\ALTIUM_TOOL\PCB_FOOTPRINTS\Altium_Footprint_Lib.PcbLib; PCB Footprint: RES0201_0-5
R553 = RESISTOR_Dup2: RES 49.9K 1/16W 1% 0402; Part Reference: R553; Mistral Part No: 110009030902-R; Mfr_name: VISHAY; Mfr_part_number: CRCW040249K9FKED; Part_type: RESISTORS\FIXED; Project: OMAP_EVM; Voltage: NA; Customs_HS_Code: 85332119; Custom_Duty: 15%; Value: 49.9K_1%; Footprint Ref: RES0402_0-5; Tolerance: 1%; Wattage: 1/16W; Package: 0402; Distributor_name: DIGIKEY; Distributor_part_number: 541-49.9KLCT-ND; Library Ref: RESISTOR; Height: 0.40MM; Weight: 0.65mg; Temperature: -55°C+155°C; Datasheet: Y:\MIS_DATABASE\DATASHEETS\RESISTORS\CRCW0603.PDF; Crtd /date: USMAN/060109; Chkd/date: MANIRAJA/190318; MECHANICAL 3D STEP FILE: RES0402_0-5; Library Path: Y:\MIS_DATABASE\Library\ALTIUM_TOOL\SCHEMATICS_PARTS\MS_DISCRETE_Library.schlib; Footprint Path: Y:\MIS_DATABASE\Library\ALTIUM_TOOL\PCB_FOOTPRINTS\Altium_Footprint_Lib.PcbLib; PCB Footprint: RES0402_0-5
R555 = RESISTOR_Dup1: RES 0E 1/10W JUMPER 0402; Part Reference: R555; Mistral Part No: 110018030052-R; Mfr_name: PANASONIC-ECG; Mfr_part_number: ERJ-2GE0R00X; Part_type: RESISTORS\FIXED; Project: AEGIS POM; Tolerance: NA; Customs_HS_Code: 85332119; Custom_Duty: 15%; Value: 0E; PCB Footprint: RES0402_0-5; MECHANICAL 3D STEP FILE: RES0402_0-5; Voltage: NA; Wattage: 1/10W; Package: 0402; Distributor_name: DIGIKEY; Distributor_part_number: P0.0JCT-ND; Height: 0.40MM; Weight: 0.8mg; Temperature: -55°C+155°C; Datasheet: Y:\MIS_DATABASE\DATASHEETS\RESISTORS\PAN-ERJSER_NOV17.PDF; Crtd /date: NAVEED/201014; Chkd/date: VASANTHA/061216; Library Ref: RESISTOR; Footprint Ref: RES0402_0-5; Library Path: Y:\MIS_DATABASE\Library\ALTIUM_TOOL\SCHEMATICS_PARTS\MS_DISCRETE_Library.schlib; Footprint Path: Y:\MIS_DATABASE\Library\ALTIUM_TOOL\PCB_FOOTPRINTS\Altium_Footprint_Lib.PcbLib
R558 = RESISTOR_Dup1: RES 0E 1/10W JUMPER 0402; Part Reference: R558; Part_type: RESISTORS\FIXED; Mfr_part_number: ERJ-2GE0R00X; Mfr_name: PANASONIC-ECG; Mistral Part No: 110018030052-R; Custom_Duty: 15%; Customs_HS_Code: 85332119; Voltage: NA; Project: AEGIS POM; Value: 0E; Footprint Path: Y:\MIS_DATABASE\Library\ALTIUM_TOOL\PCB_FOOTPRINTS\Altium_Footprint_Lib.PcbLib; Library Path: Y:\MIS_DATABASE\Library\ALTIUM_TOOL\SCHEMATICS_PARTS\MS_DISCRETE_Library.schlib; Footprint Ref: RES0402_0-5; Library Ref: RESISTOR; Chkd/date: VASANTHA/061216; Crtd /date: NAVEED/201014; Datasheet: Y:\MIS_DATABASE\DATASHEETS\RESISTORS\PAN-ERJSER_NOV17.PDF; Temperature: -55°C+155°C; Weight: 0.8mg; Height: 0.40MM; Distributor_part_number: P0.0JCT-ND; Distributor_name: DIGIKEY; Package: 0402; Wattage: 1/10W; Tolerance: NA; MECHANICAL 3D STEP FILE: RES0402_0-5; PCB Footprint: RES0402_0-5
R559 = RESISTOR_Dup2: RES 0E 1/10W JUMPER 0402; Part Reference: R559; Part_type: RESISTORS\FIXED; Mfr_part_number: ERJ-2GE0R00X; Mfr_name: PANASONIC-ECG; Mistral Part No: 110018030052-R; Custom_Duty: 15%; Customs_HS_Code: 85332119; Voltage: NA; Project: AEGIS POM; Value: 0E; MECHANICAL 3D STEP FILE: RES0402_0-5; Chkd/date: VASANTHA/061216; Crtd /date: NAVEED/201014; Datasheet: Y:\MIS_DATABASE\DATASHEETS\RESISTORS\PAN-ERJSER_NOV17.PDF; Temperature: -55°C+155°C; Weight: 0.8mg; Height: 0.40MM; Distributor_part_number: P0.0JCT-ND; Distributor_name: DIGIKEY; Package: 0402; Wattage: 1/10W; Tolerance: NA; Library Ref: RESISTOR; Footprint Ref: RES0402_0-5; Library Path: Y:\MIS_DATABASE\Library\ALTIUM_TOOL\SCHEMATICS_PARTS\MS_DISCRETE_Library.schlib; Footprint Path: Y:\MIS_DATABASE\Library\ALTIUM_TOOL\PCB_FOOTPRINTS\Altium_Footprint_Lib.PcbLib; PCB Footprint: RES0402_0-5
R560 = RESISTOR_Dup1: RES 1K 1/20W 5% 0201; Part Reference: R560; Part_type: RESISTORS\FIXED; Mfr_part_number: RC0201JR-071KL; Mfr_name: YAGEO AMERICA; Mistral Part No: 110009030395-R; Custom_Duty: 15%; Customs_HS_Code: 85332119; Voltage: NA; Project: GOLDEN-I LITE; Value: 1K; Footprint Path: Y:\MIS_DATABASE\Library\ALTIUM_TOOL\PCB_FOOTPRINTS\Altium_Footprint_Lib.PcbLib; Library Path: Y:\MIS_DATABASE\Library\ALTIUM_TOOL\SCHEMATICS_PARTS\MS_DISCRETE_Library.schlib; MECHANICAL 3D STEP FILE: RES0201_0-5; Footprint Ref: RES0201_0-5; Library Ref: RESISTOR; Chkd/date: MANIRAJA/050517; Crtd /date: MANIRAJA/050517; Datasheet: Y:\MIS_DATABASE\DATASHEETS\RESISTORS\RCXXXXL-SER_MAR18.PDF; Temperature: -55°C+125°C; Weight: 0.17mg; Height: 0.26MM; Distributor_part_number: 311-1KNCT-ND; Distributor_name: DIGIKEY; Package: 0201; Wattage: 1/20W; Tolerance: 5%; PCB Footprint: RES0201_0-5
R564 = RESISTOR_Dup2: RES 10K 1/20W 5% 0201; Part Reference: R564; Part_type: RESISTORS\FIXED; Mfr_part_number: RC0201JR-0710KL; Mfr_name: YAGEO AMERICA; Mistral Part No: 110010070051-R; Custom_Duty: 15%; Customs_HS_Code: 85332119; Voltage: NA; Project: GOLDEN-I LITE; Value: 10K; MECHANICAL 3D STEP FILE: RES0201_0-5; Chkd/date: MANIRAJA/050517; Crtd /date: MANIRAJA/050517; Datasheet: Y:\MIS_DATABASE\DATASHEETS\RESISTORS\RCXXXXL-SER_MAR18.PDF; Temperature: -55°C+125°C; Weight: 0.17mg; Height: 0.26MM; Distributor_part_number: 311-10KNCT-ND; Distributor_name: DIGIKEY; Package: 0201; Wattage: 1/20W; Tolerance: 5%; Library Ref: RESISTOR; Footprint Ref: RES0201_0-5; Library Path: Y:\MIS_DATABASE\Library\ALTIUM_TOOL\SCHEMATICS_PARTS\MS_DISCRETE_Library.schlib; Footprint Path: Y:\MIS_DATABASE\Library\ALTIUM_TOOL\PCB_FOOTPRINTS\Altium_Footprint_Lib.PcbLib; PCB Footprint: RES0201_0-5
SW1 = SW4_430182050816: SWITCH TACTILE SPST ST SMD; Part Reference: SW1; Part_type: ELECTRO-MECHANICAL\SWITCH; Mfr_name: WURTH ELEKTRONIK; Mistral Part No: 130021010021-R; Custom_Duty: 24%; Customs_HS_Code: 85369090; Wattage: NA; Project: TI_DRA829 SK EVM BRD; Value: 430182050816; Footprint Path: Y:\MIS_DATABASE\Library\ALTIUM_TOOL\PCB_FOOTPRINTS\Altium_Footprint_Lib.PcbLib; Library Path: Y:\MIS_DATABASE\Library\ALTIUM_TOOL\SCHEMATICS_PARTS\MS_SWITCH_Library.schlib; MECHANICAL 3D STEP FILE: SW4_430182050816_240X240_SMD_5-2; Chkd/date: MANIRAJA/180121; Crtd /date: ALVY/180121; Datasheet: Y:\MIS_DATABASE\DATASHEETS\MISC\SWITCHES\4301X2XXX816.PDF; Temperature: -40°C+85°C; Weight: 220mg; Height: 5.15MM; Library Ref: SW4_430182050816; Distributor_part_number: 732-7005-1-ND; Distributor_name: DIGIKEY; Package: SMD; Voltage: NA; Tolerance: NA; Mfr_part_number: 430182050816; Footprint Ref: SW4_430182050816_240X240_SMD_5-2; PCB Footprint: SW4_430182050816_240X240_SMD_5-2
SW3 = SW4_430182050816: SWITCH TACTILE SPST ST SMD; Part Reference: SW3; Mistral Part No: 130021010021-R; Mfr_name: WURTH ELEKTRONIK; Part_type: ELECTRO-MECHANICAL\SWITCH; Project: TI_DRA829 SK EVM BRD; Tolerance: NA; Customs_HS_Code: 85369090; Custom_Duty: 24%; Value: 430182050816; Footprint Ref: SW4_430182050816_240X240_SMD_5-2; Mfr_part_number: 430182050816; Voltage: NA; Wattage: NA; Package: SMD; Distributor_name: DIGIKEY; Distributor_part_number: 732-7005-1-ND; Library Ref: SW4_430182050816; Height: 5.15MM; Weight: 220mg; Temperature: -40°C+85°C; Datasheet: Y:\MIS_DATABASE\DATASHEETS\MISC\SWITCHES\4301X2XXX816.PDF; Crtd /date: ALVY/180121; Chkd/date: MANIRAJA/180121; MECHANICAL 3D STEP FILE: SW4_430182050816_240X240_SMD_5-2; Library Path: Y:\MIS_DATABASE\Library\ALTIUM_TOOL\SCHEMATICS_PARTS\MS_SWITCH_Library.schlib; Footprint Path: Y:\MIS_DATABASE\Library\ALTIUM_TOOL\PCB_FOOTPRINTS\Altium_Footprint_Lib.PcbLib; PCB Footprint: SW4_430182050816_240X240_SMD_5-2
TP63 = TESTPOINT_Dup1: TESTPOINT CIR 30 SMD; Part Reference: TP63; Mfr_name: LOCAL; Mistral Part No: 130009030930; MECHANICAL 3D STEP FILE: NA; Project: BT MODULE_CSRBC04; Value: TP30_SMD; RoHS: NA; Footprint Ref: TP30_SMD; Library Ref: TESTPOINT; Footprint Path: Y:\MIS_DATABASE\Library\ALTIUM_TOOL\PCB_FOOTPRINTS\Altium_Footprint_Lib.PcbLib; Library Path: Y:\MIS_DATABASE\Library\ALTIUM_TOOL\SCHEMATICS_PARTS\MS_DISCRETE_Library.schlib; Datasheet: NA; Temperature: NA; Weight: NA; Wattage: NA; Voltage: NA; Tolerance: NA; Chkd/date: SHREESHAIL/171006; Crtd /date: MAZHAR/171006; Height: NA; Distributor_part_number: NA; Distributor_name: NA; Package: SMD; Part_type: TESTPOINT; Mfr_part_number: TP30_SMD; Customs_HS_Code: NA; Custom_Duty: NA; PCB Footprint: TP30_SMD
U57 = TPS3808G33DBV_SOT23-6: IC VOLT SUPERVISOR 3.3V SOT23-6; Part Reference: U57; Mistral Part No: 142010120003-R; Mfr_name: TEXAS INSTRUMENTS; Part_type: ICS\POWER\VOLTAGE REGULATOR; Automotive Alternate_mfr_part_number: TPS3808G33QDBVRQ1; Project: IEMS; Customs_HS_Code: 85423100; Custom_Duty: 15%; Value: TPS3808G33DBVR; Mfr_part_number: TPS3808G33DBVR; Package: SOT23-6; Distributor_name: DIGIKEY; Distributor_part_number: 296-17195-1-ND; Library Ref: TPS3808G33DBV_SOT23-6; Height: 1.45MM; Weight: NA; Temperature: -40°C+125°C; Datasheet: Y:\MIS_DATABASE\DATASHEETS\ICS\POWER\TPS3808G33.PDF; Crtd /date: MAZHAR/031210; Chkd/date: SUHAS/050411; RoHS: Sb/ Br FREE; Automotive Alternate_mfr_name: TEXAS INSTRUMENTS; PCB Footprint: SOT23-6
U58 = TPS3899_WSON6: IC NANO POWER PRECISION VOLTAGE SUPERVISORE PUSH BUTTON MONITOR WITH PROG SENSE AND RESET WSON6; Part Reference: U58; Mistral Part No: 142022080012-R; Mfr_name: TEXAS INSTRUMENTS; Mfr_part_number: TPS3899DL30DSER; Part_type: ICS\POWER\MANAGEMENT; Project: J7AHP EVM; Tolerance: NA; Customs_HS_Code: 85423100; Custom_Duty: 15%; Value: TPS3899; Footprint Ref: WSON6_19-68_60X60; Voltage: NA; Wattage: NA; Package: WSON6; Distributor_name: DIGIKEY; Distributor_part_number: 296-TPS3899DL30DSERCT-ND; Library Ref: TPS3899_WSON6; Height: 0.80MM; Weight: NA; Temperature: -40°C+125°C; Datasheet: Y:\MIS_DATABASE\DATASHEETS\ICS\POWER\TPS3899.PDF; Crtd /date: BEENA/030822; Chkd/date: PRAVEEN/030822; PCB Footprint: WSON6_19-68_60X60
U60 = SN74LVC1G32DBVR_SOT23-5: IC SINGAL 2 INPUT POSITIVE OR GATE SOT23-5; Part Reference: U60; Part_type: ICS\DIGITAL\GATES; Mfr_name: TEXAS INSTRUMENTS; Mistral Part No: 141009030236-R; Custom_Duty: 15%; Customs_HS_Code: 85423100; Wattage: NA; Project: SVDO_RMB_MMA; Value: SN74LVC1G32DBVR; MECHANICAL 3D STEP FILE: SOT23-5_1-5; Chkd/date: MANIRAJA/051017; Crtd /date: MAZHAR/070806; Datasheet: Y:\MIS_DATABASE\DATASHEETS\ICS\DIGITAL\GATES\SN74LVC1G32.PDF; Temperature: -40°C+85°C; Weight: 6.3mg; Height: 1.45MM; Library Ref: SN74LVC1G32DBVR_SOT23-5; Distributor_part_number: 296-9847-1-ND; Distributor_name: DIGIKEY; Package: SOT23-5; Voltage: NA; Tolerance: NA; Mfr_part_number: SN74LVC1G32DBVR; PCB Footprint: SOT23-5_1-5
U61 = SN74LVC1G97DBVT_SOT23-6: IC CONFIGURABLE MULTIPLE-FUNCTION GATE SOT23-6; Part Reference: U61; Part_type: ICS\DIGITAL\FLIP-FLOP; Mfr_name: TEXAS INSTRUMENTS; Mistral Part No: 141015030002-R; Custom_Duty: 15%; Customs_HS_Code: 85423100; Wattage: NA; Project: MEDCARDPH1; Value: SN74LVC1G97DBVT; Chkd/date: NAVEED/130715; Crtd /date: VASANTHA/180314; Datasheet: Y:\MIS_DATABASE\DATASHEETS\ICS\DIGITAL\GATES\SN74LVC1G97.PDF; Temperature: -40°C+125°C; Weight: NA; Height: 1.45MM; Library Ref: SN74LVC1G97DBVT_SOT23-6; Distributor_part_number: SN74LVC1G97DBVT-ND; Distributor_name: DIGIKEY; Package: SOT23-6; Voltage: NA; Tolerance: NA; Mfr_part_number: SN74LVC1G97DBVT; PCB Footprint: SOT23-6
U105 = SN74LVC1G08DBVRE4_SOT23-5: IC SINGLE 2-INPUT POSITIVE AND GATE SOT23-5; Part Reference: U105; Part_type: ICS\DIGITAL\GATES; Mfr_name: TEXAS INSTRUMENTS; Mistral Part No: 141009060026-R; Custom_Duty: 15%; Customs_HS_Code: 85423100; Project: KHAN_MAIN; Value: SN74LVC1G08DBVRE4; RoHS: Sb/ Br FREE; Chkd/date: SUHAS/221010; Crtd /date: USMAN/151008; Datasheet: Y:\MIS_DATABASE\DATASHEETS\ICS\DIGITAL\GATES\SN74LVC1G08.PDF; Temperature: -40°C+85°C; Height: 1.45MM; Library Ref: SN74LVC1G08DBVRE4_SOT23-5; Distributor_part_number: SN74LVC1G08DBVRE4-ND; Distributor_name: DIGIKEY; Package: SOT23-5; Mfr_part_number: SN74LVC1G08DBVRE4; PCB Footprint: SOT23-5
U106 = MAX6817_SOT23-6: IC CMOS ESD PROTECTED SWITCH SOT23-6; Part Reference: U106; Mistral Part No: 141017070009-R; Mfr_name: MAXIM; Part_type: ICS\INTERFACE; Project: TI_SVB_DUT; Tolerance: NA; Customs_HS_Code: 85423100; Custom_Duty: 15%; Value: MAX6817EUT+T; Mfr_part_number: MAX6817EUT+T; Voltage: NA; Wattage: NA; Package: SOT23-6; Distributor_name: DIGIKEY; Distributor_part_number: MAX6817EUT+TCT-ND; Library Ref: MAX6817_SOT23-6; Height: 1.45MM; Weight: 36mg; Temperature: -40°C+125°C; Datasheet: Y:\MIS_DATABASE\DATASHEETS\ICS\MISC\MAX6816.PDF; Crtd /date: MANIRAJA/210717; Chkd/date: MANIRAJA/210717; MECHANICAL 3D STEP FILE: SOT23-6_1-5; PCB Footprint: SOT23-6_1-5
U107 = SN74LVC1G08DBVRE4_SOT23-5: IC SINGLE 2-INPUT POSITIVE AND GATE SOT23-5; Part Reference: U107; Part_type: ICS\DIGITAL\GATES; Mfr_name: TEXAS INSTRUMENTS; Mistral Part No: 141009060026-R; Custom_Duty: 15%; Customs_HS_Code: 85423100; Project: KHAN_MAIN; Value: SN74LVC1G08DBVRE4; RoHS: Sb/ Br FREE; Chkd/date: SUHAS/221010; Crtd /date: USMAN/151008; Datasheet: Y:\MIS_DATABASE\DATASHEETS\ICS\DIGITAL\GATES\SN74LVC1G08.PDF; Temperature: -40°C+85°C; Height: 1.45MM; Library Ref: SN74LVC1G08DBVRE4_SOT23-5; Distributor_part_number: SN74LVC1G08DBVRE4-ND; Distributor_name: DIGIKEY; Package: SOT23-5; Mfr_part_number: SN74LVC1G08DBVRE4; PCB Footprint: SOT23-5
U108 = SN74LVC1G07DRLRG4_SOT553-5: IC SINGLE BUFFER/DRIVER SOT553-5; Part Reference: U108; Mistral Part No: 141009030406-R; Mfr_name: TEXAS INSTRUMENTS; Part_type: ICS\INTERFACE\LINE DRIVER; Project: SMART VIEW_IP CAMERA; Customs_HS_Code: 85423100; Custom_Duty: 15%; Value: SN74LVC1G07DRLRG4; Mfr_part_number: SN74LVC1G07DRLRG4; Package: SOT553-5; Distributor_name: DIGIKEY; Distributor_part_number: SN74LVC1G07DRLRG4-ND; Library Ref: SN74LVC1G07DRLRG4_SOT553-5; Height: 0.60MM; Temperature: -40°C to 85°C; Datasheet: Y:\MIS_DATABASE\DATASHEETS\ICS\INTERFACE\SN74LVC1G07.PDF; Crtd /date: MAZHAR/170907; Chkd/date: RAGESH/111110; PCB Footprint: SOT553-5
U111 = SN74LVC2G74DCTR_SSOP8: IC SINGLE POSITIVE-EDGE-TRIGGERED D-TYPE FLIP-FLOP SM8; Part Reference: U111; Mistral Part No: 141009030172-R; Mfr_name: TEXAS INSTRUMENTS; Part_type: ICS\DIGITAL\FLIP-FLOP; Wattage: NA; Project: FPI; Customs_HS_Code: 85423100; Custom_Duty: 15%; Value: SN74LVC2G74; Footprint Path: Y:\MIS_DATABASE\Library\ALTIUM_TOOL\PCB_FOOTPRINTS\Altium_Footprint_Lib.PcbLib; Library Path: Y:\MIS_DATABASE\Library\ALTIUM_TOOL\SCHEMATICS_PARTS\MS_GATE_Library.schlib; MECHANICAL 3D STEP FILE: SSOP8_25-59_120X110_1-3; Temperature: -40°C+125°C; Weight: 23.4mg; Footprint Ref: SSOP8_25-59_120X110_1-3; Voltage: NA; Tolerance: NA; Mfr_part_number: SN74LVC2G74DCTR; Package: SM8; Distributor_name: DIGIKEY; Distributor_part_number: 296-13273-1-ND; Library Ref: SN74LVC2G74DCTR_SSOP8; Height: 1.30MM; Datasheet: Y:\MIS_DATABASE\DATASHEETS\ICS\DIGITAL\GATES\SN74LVC2G74.PDF; Crtd /date: MAZHAR/070405; Chkd/date: SHREESHAIL/100106; PCB Footprint: SSOP8_25-59_120X110_1-3

## Sheet 27. CPLD.SchDoc: CPLD
size 513 x 386 mm; Project: PROC154E2(001)_SK_AM69; Issue: 1.0; RevCode: E3; Page Create Date: March  8, 1995; Variant Name: Core Design; Schematic Page Number: 27; Page Number: 27; Page Size: C; Comment: MISTRAL_TITLEBLK_CSIZE_1; Page Count: 62; Schematic Page Count: 62; Name: PROC154E2 001 SK AM69; DsnPath: C:\Users\danie\Downloads\sprr466c\PROC154E3_RP\PROC154E3_SCH.DSN; SchematicName: SCHEMATIC1; PageName: 27. CPLD; PageSize: C; TopSchematic: True
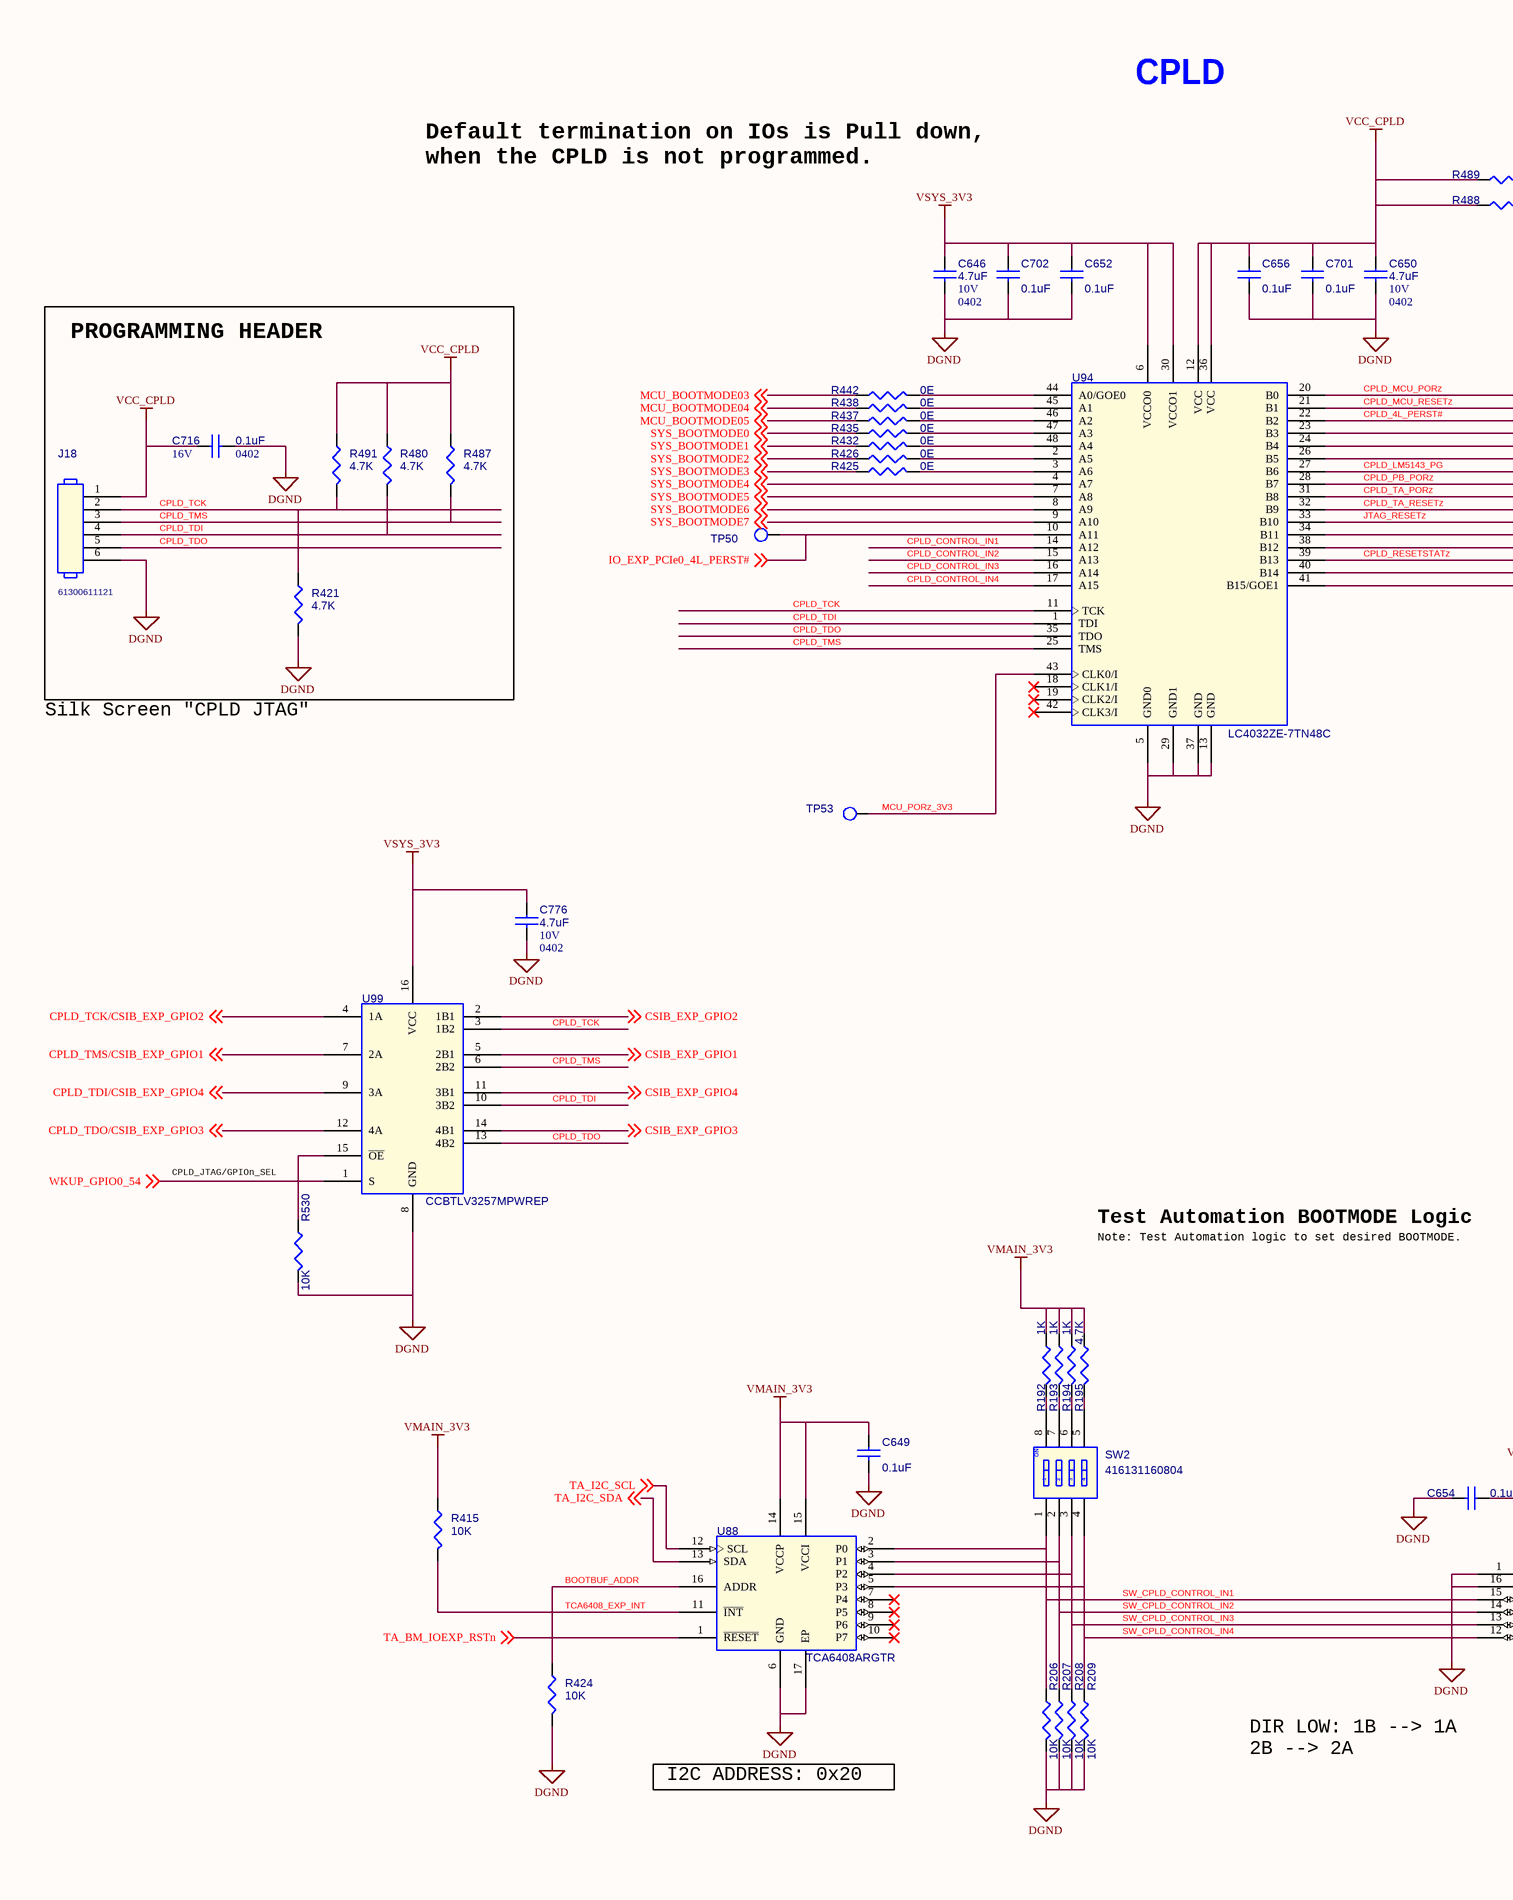
[diagram p42: 27. CPLD.SchDoc, left]
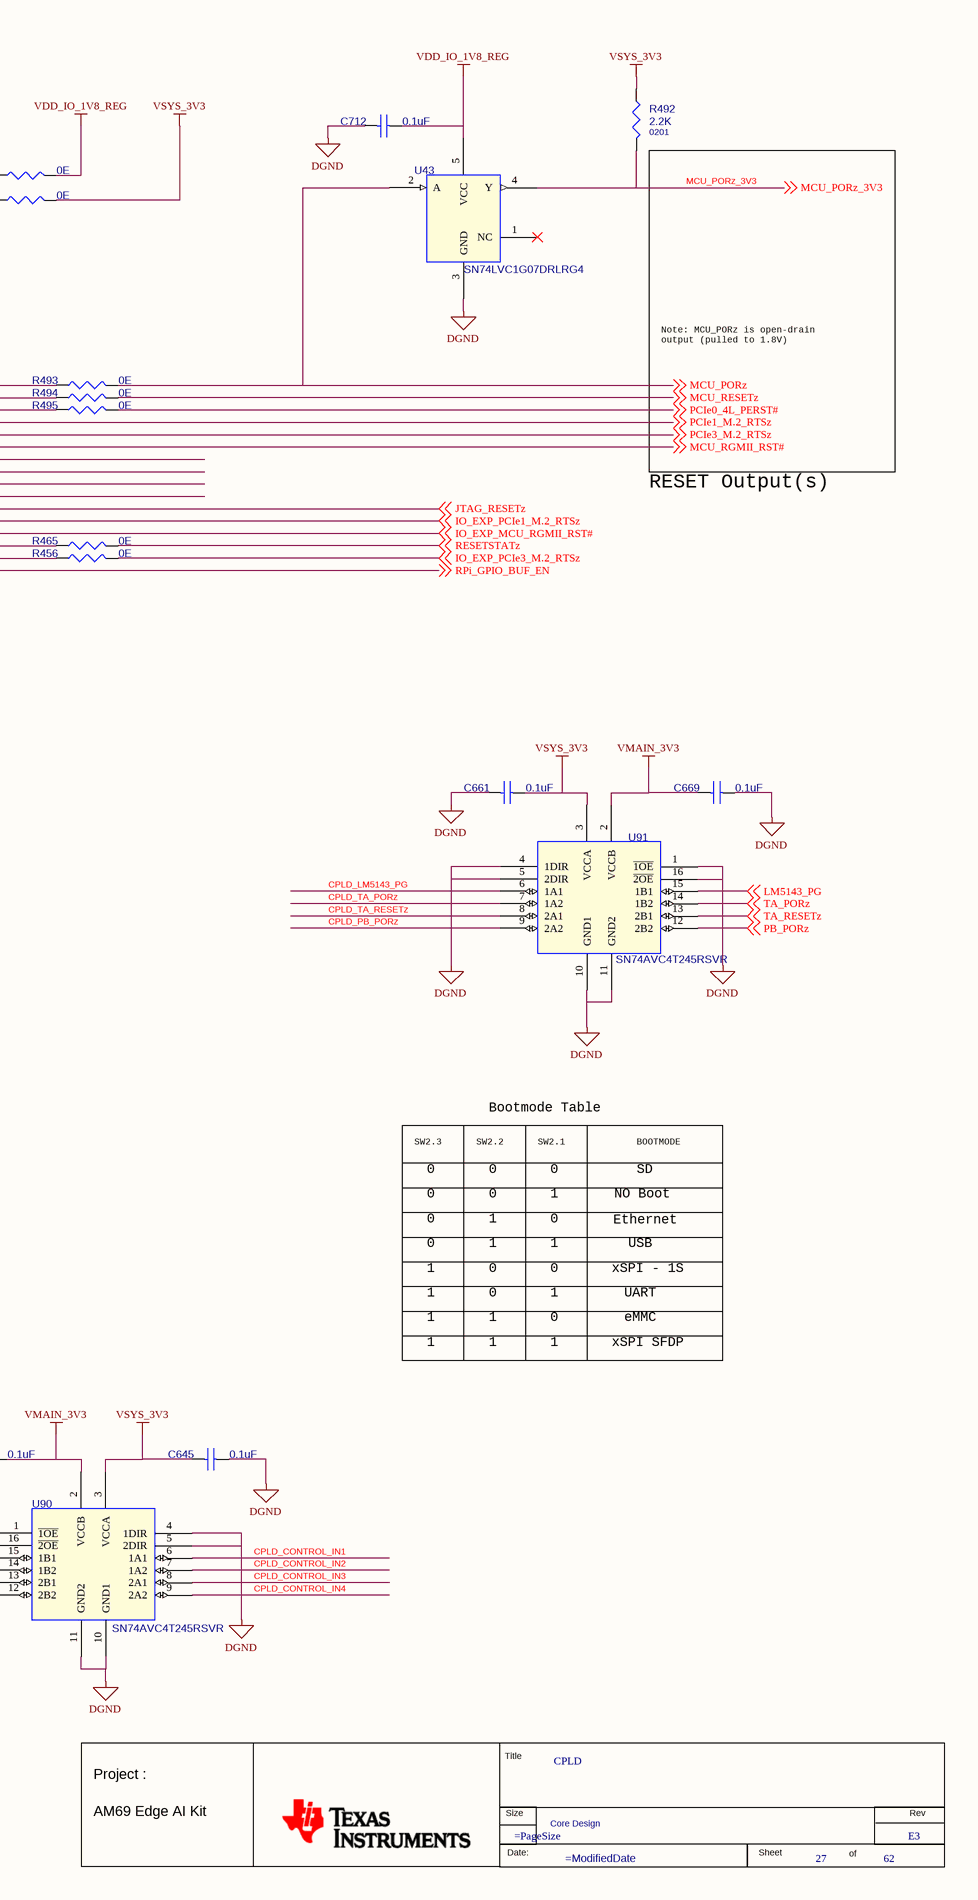
[diagram p43: 27. CPLD.SchDoc, right]

### Parts
(Parts that share a designator on the sheet are numbered #1, #2 ... from top to bottom, then left to right.)
*#27  RevCode: E3  Title: CPLD  Page Number: 27  Page Count: 62  Variant Name: Core Design  (hidden comment: MISTRAL_TITLEBLK_CSIZE_1)  (graphical)
C645  0.1uF  [CAP0201_0-5]
C646  4.7uF  Voltage: 10V  Package: 0402  [CAP0402_0-75]
C649  0.1uF  [CAP0201_0-5]
C650  4.7uF  Package: 0402  Voltage: 10V  [CAP0402_0-75]
C652  0.1uF  [CAP0201_0-5]
C654  0.1uF  [CAP0201_0-5]
C656  0.1uF  [CAP0201_0-5]
C661  0.1uF  [CAP0201_0-5]
C669  0.1uF  [CAP0201_0-5]
C701  0.1uF  [CAP0201_0-5]
C702  0.1uF  [CAP0201_0-5]
C712  0.1uF  [CAP0201_0-5]
C716  0.1uF  Voltage: 16V  Package: 0402  [CAP0402_0-75]
C776  4.7uF  Voltage: 10V  Package: 0402  [CAP0402_0-75]
J18  Mfr_part_number: 61300611121  [HDR_1X6_61300611121_S_T_8-6]  (hidden comment: HDR_1X6)
R192  1K  [RES0201_0-5]
R193  1K  [RES0201_0-5]
R194  1K  [RES0201_0-5]
R195  4.7K  [RES0201_0-5]
R206  10K  [RES0201_0-5]
R207  10K  [RES0201_0-5]
R208  10K  [RES0201_0-5]
R209  10K  [RES0201_0-5]
R415  10K  [RES0201_0-5]
R421  4.7K  [RES0201_0-5]
R424  10K  [RES0201_0-5]
R425  0E  [RES0201_0-5]
R426  0E  [RES0201_0-5]
R432  0E  [RES0201_0-5]
R435  0E  [RES0201_0-5]
R437  0E  [RES0201_0-5]
R438  0E  [RES0201_0-5]
R442  0E  [RES0201_0-5]
R456  0E  [RES0201_0-5]
R465  0E  [RES0201_0-5]
R480  4.7K  [RES0201_0-5]
R487  4.7K  [RES0201_0-5]
R488  0E  [RES0201_0-5]
R489  0E  [RES0201_0-5]
R491  4.7K  [RES0201_0-5]
R492  2.2K  Package: 0201  [RES0201_0-5]
R493  0E  [RES0201_0-5]
R494  0E  [RES0201_0-5]
R495  0E  [RES0201_0-5]
R530  10K  [RES0201_0-5]
SW2  416131160804  [SW6_1P27_8p75x6p0_GDH]
TP50  TP18_SMD  [TP18_SMD]  (value not drawn)
TP53  TP18_SMD  [TP18_SMD]  (value not drawn)
U43  SN74LVC1G07DRLRG4  [SOT553-5_0-6]
U88  TCA6408ARGTR  [QFN16_19-68_120X120_1_EP1-6]
U90  SN74AVC4T245RSVR  [UQFN16_TMUX1574_70X100_0-6]
U91  SN74AVC4T245RSVR  [UQFN16_TMUX1574_70X100_0-6]
U94  LC4032ZE-7TN48C  [LQFP48_19-68_280X280_1-2]
U99  CCBTLV3257MPWREP  [TSSOP16_25-59_205X180_1-2]

### Blocks framed on the sheet
PROGRAMMING HEADER: C716 J18 R421 R480 R487 R491

### Nets
DGND: C645.1 C646.2 C649.2 C650.2 C652.2 C654.2 C656.2 C661.2 C669.1 C701.2 C702.2 C712.2 C716.2 C776.2 J18.6 R206.1 R207.1 R208.1 R209.1 R421.2 R424.1 R530.1 U43.3(GND) U88.6(GND) U88.17(EP) U90.1(~{1OE}) U90.4(1DIR) U90.5(2DIR) U90.10(GND1) U90.11(GND2) U90.16(~{2OE}) U91.1(~{1OE}) U91.4(1DIR) U91.5(2DIR) U91.10(GND1) U91.11(GND2) U91.16(~{2OE}) U94.5(GND0) U94.13(GND) U94.29(GND1) U94.37(GND) U99.8(GND)  [project net VDD_CPU_HCPS_GOSNS]
VCC_CPLD: C650.1 C656.1 C701.1 C716.1 J18.1 R480.1 R487.1 R488.1 R489.1 R491.1 U94.12(VCC) U94.36(VCC)
VDD_IO_1V8_REG: C712.1 R489.2 U43.5(VCC)
VMAIN_3V3: C649.1 C654.1 C669.2 R192.1 R193.1 R194.1 R195.1 R415.2 U88.14(VCCP) U88.15(VCCI) U90.2(VCCB) U91.2(VCCB)
VSYS_3V3: C645.2 C646.1 C652.1 C661.1 C702.1 C776.1 R488.2 R492.1 U90.3(VCCA) U91.3(VCCA) U94.6(VCCO0) U94.30(VCCO1) U99.16(VCC)  [project net V_3V3]
BOOTBUF_ADDR: R424.2 U88.16(ADDR)
CPLD_4L_PERST#: R495.1 U94.22(B2)
CPLD_CONTROL_IN1: U90.6(1A1) U94.14(A12)
CPLD_CONTROL_IN2: U90.7(1A2) U94.15(A13)
CPLD_CONTROL_IN3: U90.8(2A1) U94.16(A14)
CPLD_CONTROL_IN4: U90.9(2A2) U94.17(A15)
CPLD_LM5143_PG: U91.6(1A1) U94.27(B6)
CPLD_MCU_PORz: R493.1 U94.20(B0)
CPLD_MCU_RESETz: R494.1 U94.21(B1)
CPLD_PB_PORz: U91.9(2A2) U94.28(B7)
CPLD_RESETSTATz: R465.1 U94.39(B13)
CPLD_TA_PORz: U91.7(1A2) U94.31(B8)
CPLD_TA_RESETz: U91.8(2A1) U94.32(B9)
CPLD_TCK: J18.2 R421.1 R491.2 U94.11(TCK) U99.3(1B2)
CPLD_TCK/CSIB_EXP_GPIO2: U99.4(1A) ; off-sheet CPLD_TCK/CSIB_EXP_GPIO2
CPLD_TDI: J18.4 R480.2 U94.1(TDI) U99.10(3B2)
CPLD_TDI/CSIB_EXP_GPIO4: U99.9(3A) ; off-sheet CPLD_TDI/CSIB_EXP_GPIO4
CPLD_TDO: J18.5 U94.35(TDO) U99.13(4B2)
CPLD_TDO/CSIB_EXP_GPIO3: U99.12(4A) ; off-sheet CPLD_TDO/CSIB_EXP_GPIO3
CPLD_TMS: J18.3 R487.2 U94.25(TMS) U99.6(2B2)
CPLD_TMS/CSIB_EXP_GPIO1: U99.7(2A) ; off-sheet CPLD_TMS/CSIB_EXP_GPIO1
CSIB_EXP_GPIO1: U99.5(2B1) ; off-sheet CSIB_EXP_GPIO1
CSIB_EXP_GPIO2: U99.2(1B1) ; off-sheet CSIB_EXP_GPIO2
CSIB_EXP_GPIO3: U99.14(4B1) ; off-sheet CSIB_EXP_GPIO3
CSIB_EXP_GPIO4: U99.11(3B1) ; off-sheet CSIB_EXP_GPIO4
IO_EXP_MCU_RGMII_RST#: U94.38(B12) ; off-sheet IO_EXP_MCU_RGMII_RST#
IO_EXP_PCIe0_4L_PERST#: TP50.1(TP) U94.10(A11) ; off-sheet IO_EXP_PCIe0_4L_PERST#
IO_EXP_PCIe1_M.2_RTSz: U94.34(B11) ; off-sheet IO_EXP_PCIe1_M.2_RTSz
IO_EXP_PCIe3_M.2_RTSz: R456.2 ; off-sheet IO_EXP_PCIe3_M.2_RTSz
JTAG_RESETz: U94.33(B10) ; off-sheet JTAG_RESETz
LM5143_PG: U91.15(1B1) ; off-sheet LM5143_PG
MCU_BOOTMODE03: R442.1 ; off-sheet MCU_BOOTMODE03
MCU_BOOTMODE04: R438.1 ; off-sheet MCU_BOOTMODE04
MCU_BOOTMODE05: R437.1 ; off-sheet MCU_BOOTMODE05
MCU_PORZ: R493.2 U43.2(A) ; off-sheet MCU_PORz
MCU_PORz_3V3: R492.2 TP53.1(TP) U43.4(Y) U94.43(CLK0/I) ; off-sheet MCU_PORz_3V3
MCU_RESETZ: R494.2 ; off-sheet MCU_RESETz
MCU_RGMII_RST#: U94.26(B5) ; off-sheet MCU_RGMII_RST#
PB_PORz: U91.12(2B2) ; off-sheet PB_PORz
PCIe0_4L_PERST#: R495.2 ; off-sheet PCIe0_4L_PERST#
PCIe1_M.2_RTSz: U94.23(B3) ; off-sheet PCIe1_M.2_RTSz
PCIe3_M.2_RTSz: U94.24(B4) ; off-sheet PCIe3_M.2_RTSz
RESETSTATZ: R465.2 ; off-sheet RESETSTATz
RPi_GPIO_BUF_EN: U94.41(B15/GOE1) ; off-sheet RPi_GPIO_BUF_EN
SW_CPLD_CONTROL_IN1: R206.2 SW2.1 U88.2(P0) U90.15(1B1)
SW_CPLD_CONTROL_IN2: R207.2 SW2.2 U88.3(P1) U90.14(1B2)
SW_CPLD_CONTROL_IN3: R208.2 SW2.3 U88.4(P2) U90.13(2B1)
SW_CPLD_CONTROL_IN4: R209.2 SW2.4 U88.5(P3) U90.12(2B2)
SYS_BOOTMODE0: R435.1 ; off-sheet SYS_BOOTMODE0
SYS_BOOTMODE1: R432.1 ; off-sheet SYS_BOOTMODE1
SYS_BOOTMODE2: R426.1 ; off-sheet SYS_BOOTMODE2
SYS_BOOTMODE3: R425.1 ; off-sheet SYS_BOOTMODE3
SYS_BOOTMODE4: U94.4(A7) ; off-sheet SYS_BOOTMODE4
SYS_BOOTMODE5: U94.7(A8) ; off-sheet SYS_BOOTMODE5
SYS_BOOTMODE6: U94.8(A9) ; off-sheet SYS_BOOTMODE6
SYS_BOOTMODE7: U94.9(A10) ; off-sheet SYS_BOOTMODE7
TA_BM_IOEXP_RSTn: U88.1(~{RESET}) ; off-sheet TA_BM_IOEXP_RSTn
TA_I2C_SCL: U88.12(SCL) ; off-sheet TA_I2C_SCL
TA_I2C_SDA: U88.13(SDA) ; off-sheet TA_I2C_SDA
TA_PORz: U91.14(1B2) ; off-sheet TA_PORz
TA_RESETz: U91.13(2B1) ; off-sheet TA_RESETz
TCA6408_EXP_INT: R415.1 U88.11(~{INT})
WKUP_GPIO0_54: U99.1(S) ; off-sheet WKUP_GPIO0_54
NetR192_2: R192.2 SW2.8
NetR193_2: R193.2 SW2.7
NetR194_2: R194.2 SW2.6
NetR195_2: R195.2 SW2.5
NetR425_2: R425.2 U94.3(A6)
NetR426_2: R426.2 U94.2(A5)
NetR432_2: R432.2 U94.48(A4)
NetR435_2: R435.2 U94.47(A3)
NetR437_2: R437.2 U94.46(A2)
NetR438_2: R438.2 U94.45(A1)
NetR442_2: R442.2 U94.44(A0/GOE0)
NetR456_1: R456.1 U94.40(B14)
NetR530_2: R530.2 U99.15(~{OE})

Not connected (* = marked no-connect by the designer): U43 1(NC)*; U88 7(P4)* 8(P5)* 9(P6)* 10(P7)*; U94 18(CLK1/I)* 19(CLK2/I)* 42(CLK3/I)*

### Notes on the sheet
- Default termination on IOs is Pull down,
  when the CPLD is not programmed.
- CPLD
- Note: MCU_PORz is open-drain
  output (pulled to 1.8V)
- RESET Output(s)
- Silk Screen "CPLD JTAG"
- CPLD_JTAG/GPIOn_SEL
- SW2.3
- SW2.2
- Bootmode Table
- SW2.1
- BOOTMODE
- Test Automation BOOTMODE Logic
- Note: Test Automation logic to set desired BOOTMODE.
- 0
- 1
- Ethernet
- NO Boot
- SD
- xSPI - 1S
- USB
- xSPI SFDP
- UART
- eMMC
- DIR LOW: 1B --> 1A
  2B --> 2A
- I2C ADDRESS: 0x20
- (in symbol MISTRAL_TITLEBLK_CSIZE_1) Title; Project :; Size; Rev; AM69 Edge AI Kit; Date:; Sheet; of
- (in symbol SW8_GDH04S04) ON